# Altium schematic sheet 5-Memories.SchDoc
size 420 x 297 mm; CompanyName: Microchip Technology Inc.; Organization: Microchip Technology; Address1: 2355 West Chandler Blvd.; Address2: Chandler, AZ  85224; Address4: USA; SheetTitle: **; Time: Time
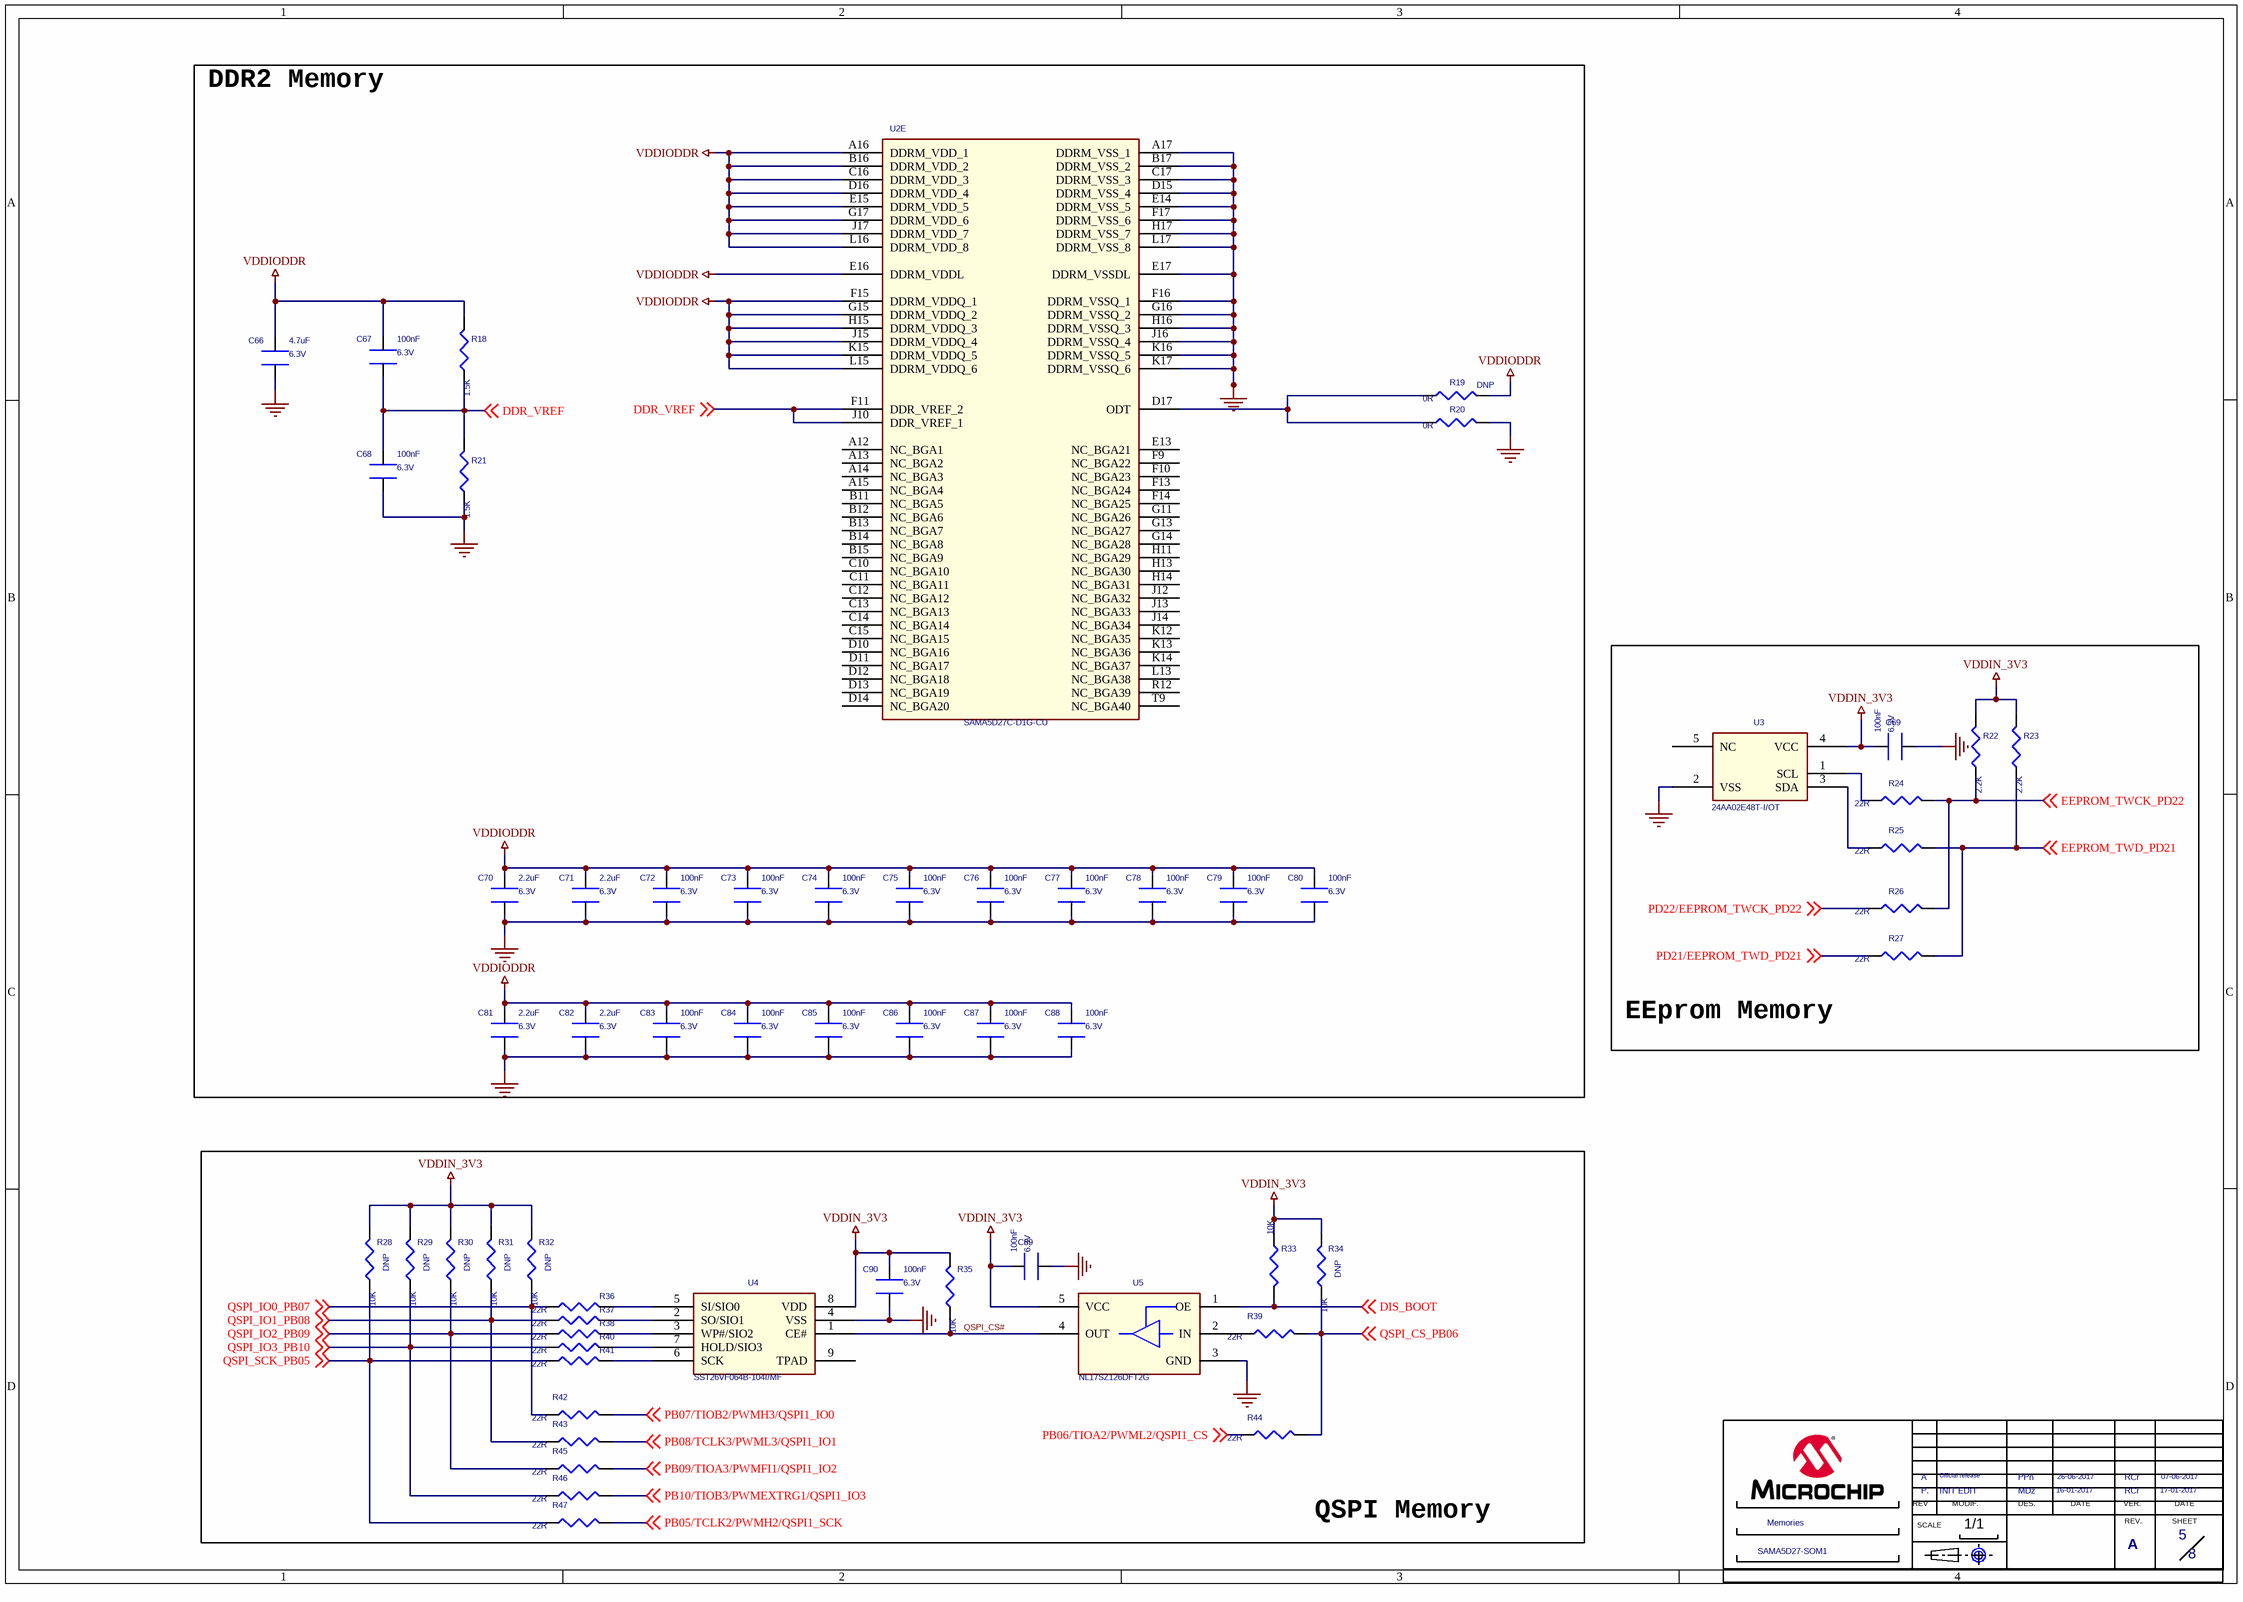
[diagram p0: 5-Memories.SchDoc]

## Parts
*  MODIF.A: INIT EDIT  SHEET NAME 2: Memories  SHEET NAME 1: SAMA5D27-SOM1  REV B: A  VERIF B: RCr  VERIF DATE A: 17-01-2017  VERIF DATE B: 07-06-2017  Page Count: 8  Page Number: 5  DATE A: 16-01-2017  DATE B: 26-06-2017  DES A: MDz  DES B: PPn  MODIF.B: Official release  REV A: P.  (hidden comment: CARTOUCHE MICROCHIP)  (graphical)
?  (no value)  (graphical)
C66  TENSION: 6.3V  VALEUR: 4.7uF  [C0402]  (hidden comment: xpF x% xV)
C67  VALEUR: 100nF  TENSION: 6.3V  [C0201]  (hidden comment: xpF x% xV)
C68  VALEUR: 100nF  TENSION: 6.3V  [C0201]  (hidden comment: xpF x% xV)
C69  VALEUR: 100nF  TENSION: 6.3V  [C0201]  (hidden comment: xpF x% xV)
C70  VALEUR: 2.2uF  TENSION: 6.3V  [C0402]  (hidden comment: xpF x% xV)
C71  VALEUR: 2.2uF  TENSION: 6.3V  [C0402]  (hidden comment: xpF x% xV)
C72  VALEUR: 100nF  TENSION: 6.3V  [C0201]  (hidden comment: xpF x% xV)
C73  VALEUR: 100nF  TENSION: 6.3V  [C0201]  (hidden comment: xpF x% xV)
C74  VALEUR: 100nF  TENSION: 6.3V  [C0201]  (hidden comment: xpF x% xV)
C75  VALEUR: 100nF  TENSION: 6.3V  [C0201]  (hidden comment: xpF x% xV)
C76  VALEUR: 100nF  TENSION: 6.3V  [C0201]  (hidden comment: xpF x% xV)
C77  VALEUR: 100nF  TENSION: 6.3V  [C0201]  (hidden comment: xpF x% xV)
C78  VALEUR: 100nF  TENSION: 6.3V  [C0201]  (hidden comment: xpF x% xV)
C79  VALEUR: 100nF  TENSION: 6.3V  [C0201]  (hidden comment: xpF x% xV)
C80  VALEUR: 100nF  TENSION: 6.3V  [C0201]  (hidden comment: xpF x% xV)
C81  VALEUR: 2.2uF  TENSION: 6.3V  [C0402]  (hidden comment: xpF x% xV)
C82  VALEUR: 2.2uF  TENSION: 6.3V  [C0402]  (hidden comment: xpF x% xV)
C83  VALEUR: 100nF  TENSION: 6.3V  [C0201]  (hidden comment: xpF x% xV)
C84  VALEUR: 100nF  TENSION: 6.3V  [C0201]  (hidden comment: xpF x% xV)
C85  VALEUR: 100nF  TENSION: 6.3V  [C0201]  (hidden comment: xpF x% xV)
C86  VALEUR: 100nF  TENSION: 6.3V  [C0201]  (hidden comment: xpF x% xV)
C87  VALEUR: 100nF  TENSION: 6.3V  [C0201]  (hidden comment: xpF x% xV)
C88  VALEUR: 100nF  TENSION: 6.3V  [C0201]  (hidden comment: xpF x% xV)
C89  VALEUR: 100nF  TENSION: 6.3V  [C0201]  (hidden comment: xpF x% xV)
C90  VALEUR: 100nF  TENSION: 6.3V  [C0201]  (hidden comment: xpF x% xV)
R18  VALEUR: 1.5K  [R0201]  (hidden comment: xR x% xW)
R19  VALEUR: 0R  [R0201]  (hidden comment: xR x% xW)
R20  VALEUR: 0R  [R0201]  (hidden comment: xR x% xW)
R21  VALEUR: 1.5K  [R0201]  (hidden comment: xR x% xW)
R22  VALEUR: 2.2K  [R0201]  (hidden comment: xR x% xW)
R23  VALEUR: 2.2K  [R0201]  (hidden comment: xR x% xW)
R24  VALEUR: 22R  [R0201]  (hidden comment: xR x% xW)
R25  VALEUR: 22R  [R0201]  (hidden comment: xR x% xW)
R26  VALEUR: 22R  [R0201]  (hidden comment: xR x% xW)
R27  VALEUR: 22R  [R0201]  (hidden comment: xR x% xW)
R28  VALEUR: 10K  [R0201]  (hidden comment: xR x% xW)
R29  VALEUR: 10K  [R0201]  (hidden comment: xR x% xW)
R30  VALEUR: 10K  [R0201]  (hidden comment: xR x% xW)
R31  VALEUR: 10K  [R0201]  (hidden comment: xR x% xW)
R32  VALEUR: 10K  [R0201]  (hidden comment: xR x% xW)
R33  VALEUR: 10K  [R0201]  (hidden comment: xR x% xW)
R34  VALEUR: 10K  [R0201]  (hidden comment: xR x% xW)
R35  VALEUR: 10K  [R0201]  (hidden comment: xR x% xW)
R36  VALEUR: 22R  [R0201]  (hidden comment: xR x% xW)
R37  VALEUR: 22R  [R0201]  (hidden comment: xR x% xW)
R38  VALEUR: 22R  [R0201]  (hidden comment: xR x% xW)
R39  VALEUR: 22R  [R0201]  (hidden comment: xR x% xW)
R40  VALEUR: 22R  [R0201]  (hidden comment: xR x% xW)
R41  VALEUR: 22R  [R0201]  (hidden comment: xR x% xW)
R42  VALEUR: 22R  [R0201]  (hidden comment: xR x% xW)
R43  VALEUR: 22R  [R0201]  (hidden comment: xR x% xW)
R44  VALEUR: 22R  [R0201]  (hidden comment: xR x% xW)
R45  VALEUR: 22R  [R0201]  (hidden comment: xR x% xW)
R46  VALEUR: 22R  [R0201]  (hidden comment: xR x% xW)
R47  VALEUR: 22R  [R0201]  (hidden comment: xR x% xW)
U2  SAMA5D27C-D1G-CU  [BGA289_02]  (part E of 7)
U3  24AA02E48T-I/OT  [SOT23-5_02]
U4  SST26VF064B-104I/MF  [WDFN08_01]
U5  NL17SZ126DFT2G  [SOT353_01]

## Blocks framed on the sheet
DDR2 Memory: C66-C68 C70-C88 R18-R21 U2
EEprom Memory: C69 R22-R27 U3
QSPI Memory: ? C89 C90 R28-R47 U4 U5

## Nets
GND: C66.1 C68.1 C69.1 C70.1 C71.1 C72.1 C73.1 C74.1 C75.1 C76.1 C77.1 C78.1 C79.1 C80.1 C81.1 C82.1 C83.1 C84.1 C85.1 C86.1 C87.1 C88.1 C89.1 C90.1 R20.2 R21.1 U2.A17(DDRM_VSS_1) U2.B17(DDRM_VSS_2) U2.C17(DDRM_VSS_3) U2.D15(DDRM_VSS_4) U2.E14(DDRM_VSS_5) U2.E17(DDRM_VSSDL) U2.F16(DDRM_VSSQ_1) U2.F17(DDRM_VSS_6) U2.G16(DDRM_VSSQ_2) U2.H16(DDRM_VSSQ_3) U2.H17(DDRM_VSS_7) U2.J16(DDRM_VSSQ_4) U2.K16(DDRM_VSSQ_5) U2.K17(DDRM_VSSQ_6) U2.L17(DDRM_VSS_8) U3.2(VSS) U4.4(VSS) U5.3(GND)
VDDIN_3V3: C69.2 C89.2 C90.2 R22.2 R23.2 R28.2 R29.2 R30.2 R31.2 R32.2 R33.1 R34.2 R35.2 U3.4(VCC) U4.8(VDD) U5.5(VCC)
VDDIODDR: C66.2 C67.2 C70.2 C71.2 C72.2 C73.2 C74.2 C75.2 C76.2 C77.2 C78.2 C79.2 C80.2 C81.2 C82.2 C83.2 C84.2 C85.2 C86.2 C87.2 C88.2 R18.2 R19.2 U2.A16(DDRM_VDD_1) U2.B16(DDRM_VDD_2) U2.C16(DDRM_VDD_3) U2.D16(DDRM_VDD_4) U2.E15(DDRM_VDD_5) U2.E16(DDRM_VDDL) U2.F15(DDRM_VDDQ_1) U2.G15(DDRM_VDDQ_2) U2.G17(DDRM_VDD_6) U2.H15(DDRM_VDDQ_3) U2.J15(DDRM_VDDQ_4) U2.J17(DDRM_VDD_7) U2.K15(DDRM_VDDQ_5) U2.L15(DDRM_VDDQ_6) U2.L16(DDRM_VDD_8)
DDR_VREF: C67.1 C68.2 R18.1 R21.2 U2.F11(DDR_VREF_2) U2.J10(DDR_VREF_1) ; off-sheet DDR_VREF
DIS_BOOT: R33.2 U5.1(OE) ; off-sheet DIS_BOOT
EEPROM_TWCK_PD22: R22.1 R24.2 R26.2 ; off-sheet EEPROM_TWCK_PD22
EEPROM_TWD_PD21: R23.1 R25.2 R27.2 ; off-sheet EEPROM_TWD_PD21
PB05/TCLK2/PWMH2/QSPI1_SCK: R47.2 ; off-sheet PB05/TCLK2/PWMH2/QSPI1_SCK
PB06/TIOA2/PWML2/QSPI1_CS: R44.1 ; off-sheet PB06/TIOA2/PWML2/QSPI1_CS
PB07/TIOB2/PWMH3/QSPI1_IO0: R42.2 ; off-sheet PB07/TIOB2/PWMH3/QSPI1_IO0
PB08/TCLK3/PWML3/QSPI1_IO1: R43.2 ; off-sheet PB08/TCLK3/PWML3/QSPI1_IO1
PB09/TIOA3/PWMFI1/QSPI1_IO2: R45.2 ; off-sheet PB09/TIOA3/PWMFI1/QSPI1_IO2
PB10/TIOB3/PWMEXTRG1/QSPI1_IO3: R46.2 ; off-sheet PB10/TIOB3/PWMEXTRG1/QSPI1_IO3
PD21/EEPROM_TWD_PD21: R27.1 ; off-sheet PD21/EEPROM_TWD_PD21
PD22/EEPROM_TWCK_PD22: R26.1 ; off-sheet PD22/EEPROM_TWCK_PD22
QSPI_CS#: R35.1 U4.1(CE#) U5.4(OUT)
QSPI_CS_PB06: R34.1 R39.2 R44.2 ; off-sheet QSPI_CS_PB06
QSPI_IO0_PB07: R32.1 R36.1 R42.1 ; off-sheet QSPI_IO0_PB07
QSPI_IO1_PB08: R31.1 R37.1 R43.1 ; off-sheet QSPI_IO1_PB08
QSPI_IO2_PB09: R30.1 R38.1 R45.1 ; off-sheet QSPI_IO2_PB09
QSPI_IO3_PB10: R29.1 R40.1 R46.1 ; off-sheet QSPI_IO3_PB10
QSPI_SCK_PB05: R28.1 R41.1 R47.1 ; off-sheet QSPI_SCK_PB05
NetR19_1: R19.1 R20.1 U2.D17(ODT)
NetR24_1: R24.1 U3.1(SCL)
NetR25_1: R25.1 U3.3(SDA)
NetR36_2: R36.2 U4.5(SI/SIO0)
NetR37_2: R37.2 U4.2(SO/SIO1)
NetR38_2: R38.2 U4.3(WP#/SIO2)
NetR39_1: R39.1 U5.2(IN)
NetR40_2: R40.2 U4.7(HOLD/SIO3)
NetR41_2: R41.2 U4.6(SCK)

Not connected (* = marked no-connect by the designer): U2 A12(NC_BGA1) A13(NC_BGA2) A14(NC_BGA3) A15(NC_BGA4) B11(NC_BGA5) B12(NC_BGA6) B13(NC_BGA7) B14(NC_BGA8) B15(NC_BGA9) C10(NC_BGA10) C11(NC_BGA11) C12(NC_BGA12) C13(NC_BGA13) C14(NC_BGA14) C15(NC_BGA15) D10(NC_BGA16) D11(NC_BGA17) D12(NC_BGA18) D13(NC_BGA19) D14(NC_BGA20) E13(NC_BGA21) F9(NC_BGA22) F10(NC_BGA23) F13(NC_BGA24) F14(NC_BGA25) G11(NC_BGA26) G13(NC_BGA27) G14(NC_BGA28) H11(NC_BGA29) H13(NC_BGA30) H14(NC_BGA31) J12(NC_BGA32) J13(NC_BGA33) J14(NC_BGA34) K12(NC_BGA35) K13(NC_BGA36) K14(NC_BGA37) L13(NC_BGA38) R12(NC_BGA39) T9(NC_BGA40); U3 5(NC); U4 9(TPAD)

## Notes on the sheet
- Drawn By:
- Engineer:
- PartNumber:
- Project Title
- Sheet Title
- Size
- B
- Revision:
- Sch #:
- Date:
- Sheet
- Designed with
- Altium.com <http://go.altium.com/MicrochipLandingPage_Evaluation.html>
- File:
- (in symbol CARTOUCHE MICROCHIP) REV; MODIF.; DES.; DATE; VER.; SCALE; REV.; SHEET; 1/1

## Library data of the parts
* = CARTOUCHE MICROCHIP: REV D: D; REV C: C; REV F: F; REV E: E; VERIF F: XXX; VERIF DATE F: XX-XXX-XX; MODIF.C: RevC; MODIF.D: RevD; MODIF.E: RevE; MODIF.F: RevF; VERIF E: XXX; VERIF D: XXX; VERIF C: RCr; VERIF A: RCr; VERIF DATE E: XX-XXX-XX; VERIF DATE D: XX-XXX-XX; VERIF DATE C: 07-06-2017; REV: A; FT: ?; Page Size: A; Page Create Date: june 19, 2004; DATE C: 07-06-2017; DATE D: XX-XXX-XX; DATE E: XX-XXX-XX; DATE F: XX-XXX-XX; DES E: XXX; DES F: XXX; DES C: XXX; DES D: XXX
? = Title Block B
C66 = C0402-4.7uF-X5R-6.3V-10%: COURANT: xA; HAUTEUR: xmm; TOLERENCE: 10%; DESIGNATION: Condensateur CMS céramique; BOITIER: 0402; DIELECTRIQUE: X5R; TEMPERATURE: 40°C/+85°C
C67-C69 C72-C80 C83-C90 = C0201-100nF-X5R-6.3V: DIELECTRIQUE: X5R; BOITIER: 0201; DESIGNATION: Condensateur CMS céramique; TOLERENCE: ?%; HAUTEUR: xmm; COURANT: xA; TEMPERATURE: 40°C/+85°C
C70 C71 C81 C82 = C0402-2.2uF-X5R-6.3V: DIELECTRIQUE: X5R; BOITIER: 0402; DESIGNATION: Condensateur CMS céramique; TOLERENCE: ?%; HAUTEUR: xmm; COURANT: xA; TEMPERATURE: 40°C/+85°C
R18 R21 = R0201-1.5K-1%: TENSION: xV; BOITIER: 0201; COURANT: xA; DESIGNATION: Resistance CMS; TOLERANCE: 1%; PUISSANCE: xW; TEMPERATURE: -40°C/+85°C
R19 R20 = R0201-0R: TENSION: xV; BOITIER: 0201; COURANT: xA; DESIGNATION: Resistance CMS; PUISSANCE: xW; TEMPERATURE: -40°C/+85°C; TOLERANCE: x%
  R19: DNP: DNP
R22 R23 = R0201-2.2K-5%: TOLERANCE: 5%; DESIGNATION: Resistance CMS; COURANT: xA; BOITIER: 0201; TENSION: xV; TEMPERATURE: -40°C/+85°C; PUISSANCE: xW
R24-R27 R36-R47 = R0201-22R-5%: TENSION: xV; BOITIER: 0201; COURANT: xA; DESIGNATION: Resistance CMS; TOLERANCE: 5%; PUISSANCE: xW; TEMPERATURE: -40°C/+85°C
R28-R32 R34 = R0201-10K-5%-DNP: TOLERANCE: 5%; DESIGNATION: Resistance CMS; COURANT: xA; BOITIER: 0201; TENSION: xV; TEMPERATURE: -40°C/+85°C; PUISSANCE: xW; DNP: DNP
R33 R35 = R0201-10K-5%: TENSION: xV; BOITIER: 0201; COURANT: xA; DESIGNATION: Resistance CMS; TOLERANCE: 5%; PUISSANCE: xW; TEMPERATURE: -40°C/+85°C
U2 = SAMA5D27C-D1G-CU: DESIGNATION: SAMA5D27-SiP; FABRICANT: ATMEL; SPLIT_INST: TRUE; SWAP_INFO: (S1+S2+S3+S4+S5+S6+S7); TEMPERATURE: -40°C/+85°C
U3 = 24AA02E48T-I-OT: FABRICANT: MICROCHIP; DESIGNATION: EEPROM 2K, 256x8 1.8V Serial EE; TEMPERATURE: -40°C/+85°C
U4 = SST26VF064B-104I-MF: FABRICANT: MICROCHIP; DESIGNATION: Flash Memory 64Mb 2.7-3.6V SQI Flash Memory; TEMPERATURE: -40°C/+85°C
U5 = NL17SZ126DFT2G: FABRICANT: ON SEMI; DESIGNATION: Buffers & Line Drivers 1.65-5.5V Single Non-Inverting; TEMPERATURE: -65°C/+150°C